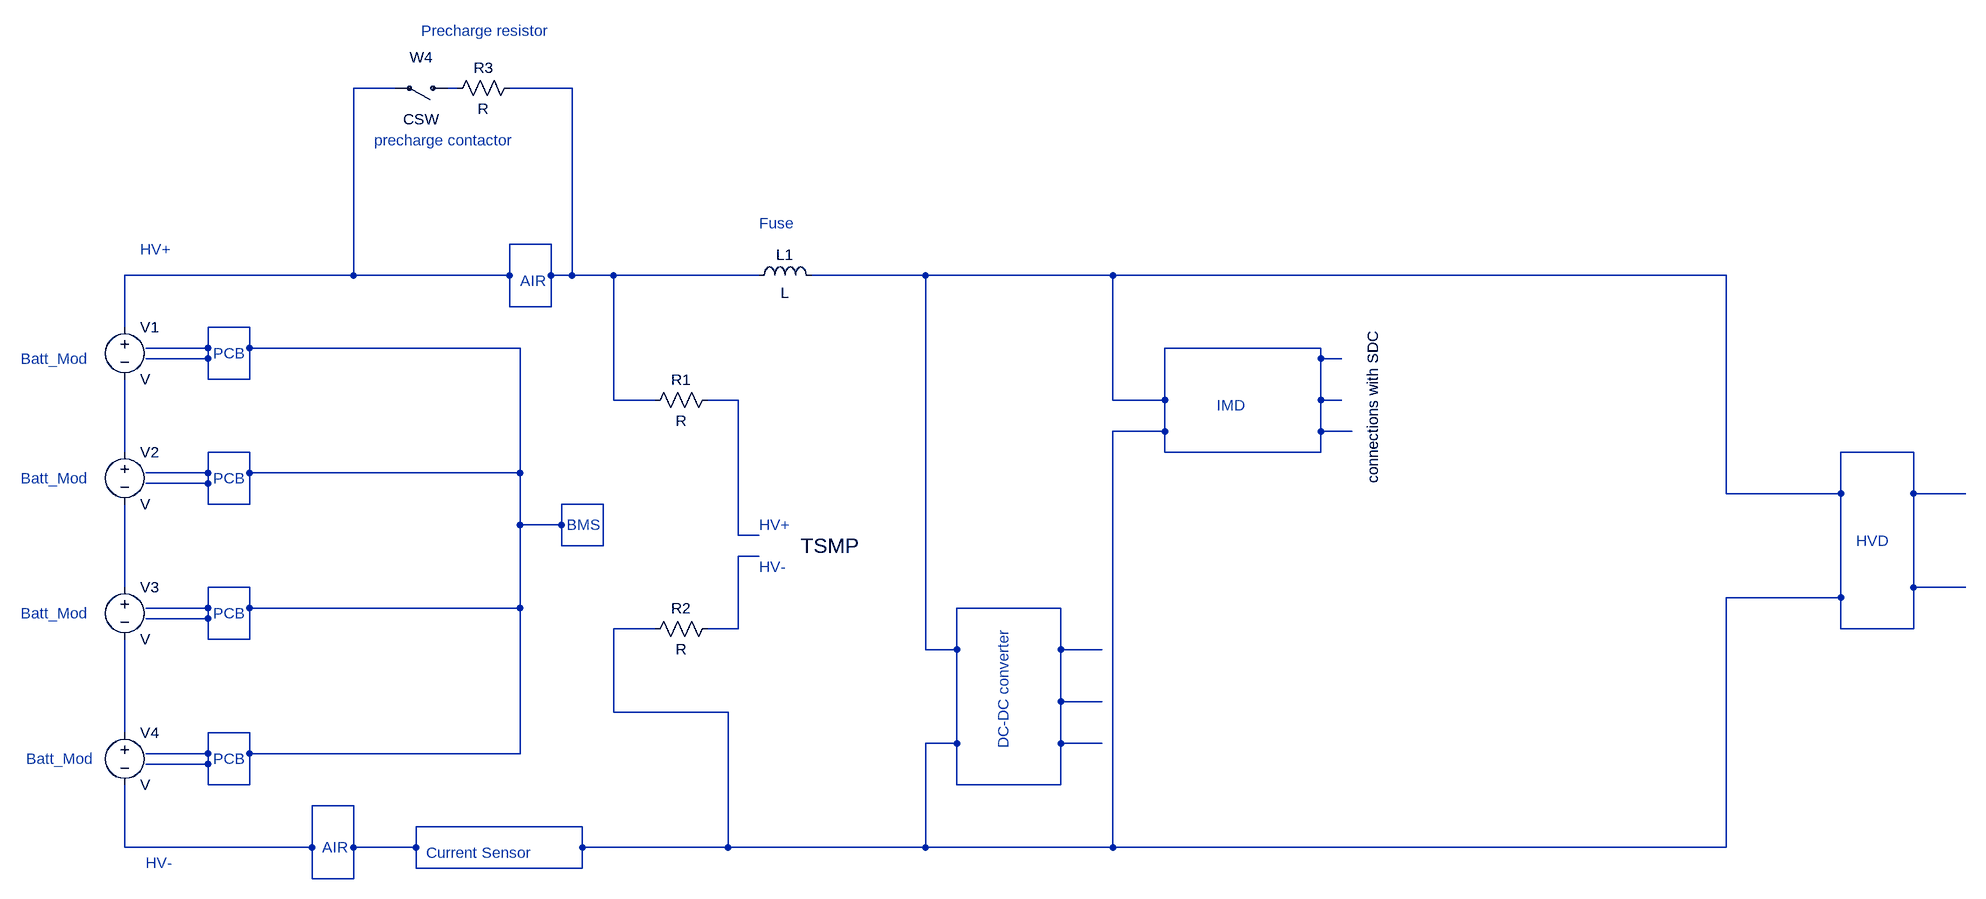
[diagram p0: schematic final.asc]
final.asc, the LTspice schematic file:
Version 4
SHEET 1 2452 692
WIRE 32 -656 -32 -656
WIRE 128 -656 112 -656
WIRE 304 -656 208 -656
WIRE 272 -416 208 -416
WIRE -32 -368 -32 -656
WIRE -32 -368 -384 -368
WIRE 208 -368 208 -416
WIRE 208 -368 -32 -368
WIRE 272 -368 272 -416
WIRE 304 -368 304 -656
WIRE 304 -368 272 -368
WIRE 368 -368 304 -368
WIRE 592 -368 368 -368
WIRE 848 -368 672 -368
WIRE 1136 -368 848 -368
WIRE 2080 -368 1136 -368
WIRE 208 -320 208 -368
WIRE 272 -320 272 -368
WIRE 272 -320 208 -320
WIRE -384 -288 -384 -368
WIRE -192 -288 -256 -288
WIRE -256 -256 -256 -288
WIRE -256 -256 -352 -256
WIRE -192 -256 -192 -288
WIRE 224 -256 -192 -256
WIRE 1456 -256 1216 -256
WIRE -256 -240 -256 -256
WIRE -256 -240 -352 -240
WIRE 1456 -240 1456 -256
WIRE 1488 -240 1456 -240
WIRE -256 -208 -256 -240
WIRE -192 -208 -192 -256
WIRE -192 -208 -256 -208
WIRE 368 -176 368 -368
WIRE 432 -176 368 -176
WIRE 560 -176 512 -176
WIRE 1136 -176 1136 -368
WIRE 1216 -176 1216 -256
WIRE 1216 -176 1136 -176
WIRE 1456 -176 1456 -240
WIRE 1488 -176 1456 -176
WIRE 1216 -128 1216 -176
WIRE 1216 -128 1136 -128
WIRE 1456 -128 1456 -176
WIRE 1504 -128 1456 -128
WIRE -384 -96 -384 -208
WIRE -192 -96 -256 -96
WIRE 1216 -96 1216 -128
WIRE 1456 -96 1456 -128
WIRE 1456 -96 1216 -96
WIRE 2368 -96 2256 -96
WIRE -256 -64 -256 -96
WIRE -256 -64 -352 -64
WIRE -192 -64 -192 -96
WIRE 224 -64 224 -256
WIRE 224 -64 -192 -64
WIRE -256 -48 -256 -64
WIRE -256 -48 -352 -48
WIRE 2080 -32 2080 -368
WIRE 2256 -32 2256 -96
WIRE 2256 -32 2080 -32
WIRE 2368 -32 2368 -96
WIRE 2448 -32 2368 -32
WIRE -256 -16 -256 -48
WIRE -192 -16 -192 -64
WIRE -192 -16 -256 -16
WIRE 352 -16 288 -16
WIRE 224 16 224 -64
WIRE 288 16 288 -16
WIRE 288 16 224 16
WIRE 560 32 560 -176
WIRE 592 32 560 32
WIRE 288 48 288 16
WIRE 352 48 352 -16
WIRE 352 48 288 48
WIRE 592 64 560 64
WIRE -384 112 -384 -16
WIRE -192 112 -256 112
WIRE 2368 112 2368 -32
WIRE 2448 112 2368 112
WIRE 2256 128 2256 -32
WIRE 2256 128 2080 128
WIRE -256 144 -256 112
WIRE -256 144 -352 144
WIRE -192 144 -192 112
WIRE 224 144 224 16
WIRE 224 144 -192 144
WIRE 1056 144 896 144
WIRE -256 160 -256 144
WIRE -256 160 -352 160
WIRE 432 176 368 176
WIRE 560 176 560 64
WIRE 560 176 512 176
WIRE 2256 176 2256 128
WIRE 2368 176 2368 112
WIRE 2368 176 2256 176
WIRE -256 192 -256 160
WIRE -192 192 -192 144
WIRE -192 192 -256 192
WIRE 848 208 848 -368
WIRE 896 208 896 144
WIRE 896 208 848 208
WIRE 1056 208 1056 144
WIRE 1120 208 1056 208
WIRE 1056 288 1056 208
WIRE 1120 288 1056 288
WIRE 368 304 368 176
WIRE 544 304 368 304
WIRE -384 336 -384 192
WIRE -192 336 -256 336
WIRE 896 352 896 208
WIRE 896 352 848 352
WIRE 1056 352 1056 288
WIRE 1120 352 1056 352
WIRE -256 368 -256 336
WIRE -256 368 -352 368
WIRE -192 368 -192 336
WIRE 224 368 224 144
WIRE 224 368 -192 368
WIRE -256 384 -256 368
WIRE -256 384 -352 384
WIRE -256 416 -256 384
WIRE -192 416 -192 368
WIRE -192 416 -256 416
WIRE 896 416 896 352
WIRE 1056 416 1056 352
WIRE 1056 416 896 416
WIRE -32 448 -96 448
WIRE 320 480 64 480
WIRE -384 512 -384 416
WIRE -96 512 -96 448
WIRE -96 512 -384 512
WIRE -32 512 -32 448
WIRE 64 512 64 480
WIRE 64 512 -32 512
WIRE 320 512 320 480
WIRE 544 512 544 304
WIRE 544 512 320 512
WIRE 848 512 848 352
WIRE 848 512 544 512
WIRE 1136 512 1136 -128
WIRE 1136 512 848 512
WIRE 2080 512 2080 128
WIRE 2080 512 1136 512
WIRE 64 544 64 512
WIRE 320 544 320 512
WIRE 320 544 64 544
WIRE -96 560 -96 512
WIRE -32 560 -32 512
WIRE -32 560 -96 560
SYMBOL voltage -384 -304 R0
SYMATTR InstName V1
SYMBOL voltage -384 -112 R0
SYMATTR InstName V2
SYMBOL voltage -384 96 R0
SYMATTR InstName V3
SYMBOL voltage -384 320 R0
SYMATTR InstName V4
SYMBOL ind 576 -352 R270
WINDOW 0 32 56 VTop 2
WINDOW 3 5 56 VBottom 2
SYMATTR InstName L1
SYMBOL res 528 -192 R90
WINDOW 0 0 56 VBottom 2
WINDOW 3 32 56 VTop 2
SYMATTR InstName R1
SYMBOL res 528 160 R90
WINDOW 0 0 56 VBottom 2
WINDOW 3 32 56 VTop 2
SYMATTR InstName R2
SYMBOL csw 112 -656 R90
WINDOW 0 -32 40 VBottom 2
WINDOW 3 32 40 VTop 2
SYMATTR InstName W4
SYMBOL res 224 -672 R90
WINDOW 0 0 56 VBottom 2
WINDOW 3 32 56 VTop 2
SYMATTR InstName R3
TEXT -248 -248 Left 2 ;PCB
TEXT -248 -56 Left 2 ;PCB
TEXT -248 152 Left 2 ;PCB
TEXT -248 376 Left 2 ;PCB
TEXT 296 16 Left 2 ;BMS
TEXT -544 -240 Left 2 ;Batt_Mod
TEXT -544 -56 Left 2 ;Batt_Mod
TEXT -544 152 Left 2 ;Batt_Mod
TEXT -536 376 Left 2 ;Batt_Mod
TEXT 224 -360 Left 2 ;AIR
TEXT -80 512 Left 2 ;AIR
TEXT 592 -448 Left 2 ;Fuse
TEXT 1296 -168 Left 2 ;IMD
TEXT -360 -408 Left 2 ;HV+
TEXT -352 536 Left 2 ;HV-
TEXT 1536 -48 VLeft 2 !connections with SDC
TEXT 2280 40 Left 2 ;HVD
TEXT 968 360 VLeft 2 ;DC-DC converter
TEXT 80 520 Left 2 ;Current Sensor
TEXT 592 16 Left 2 ;HV+
TEXT 592 80 Left 2 ;HV-
TEXT 656 48 Left 3 !TSMP
TEXT 72 -744 Left 2 ;Precharge resistor
TEXT 0 -576 Left 2 ;precharge contactor

The netlist it stands for:
* final.asc
V1 N001 N006 V
V2 N006 N008 V
V3 N008 N009 V
V4 N009 N003 V
L1 N001 N003 L
R1 N005 N001 R
R2 N007 N003 R
W4 N002 N001 CSW
R3 N001 N002 R
* PCB
* PCB
* PCB
* PCB
* BMS
* Batt_Mod
* Batt_Mod
* Batt_Mod
* Batt_Mod
* AIR
* AIR
* Fuse
* IMD
* HV+
* HV-
connections with SDC
* HVD
* DC-DC converter
* Current Sensor
* HV+
* HV-
TSMP
* Precharge resistor
* precharge contactor
.backanno
.end